# EAGLE design STM32F10XCXT6 (EAGLE 9.6.2)
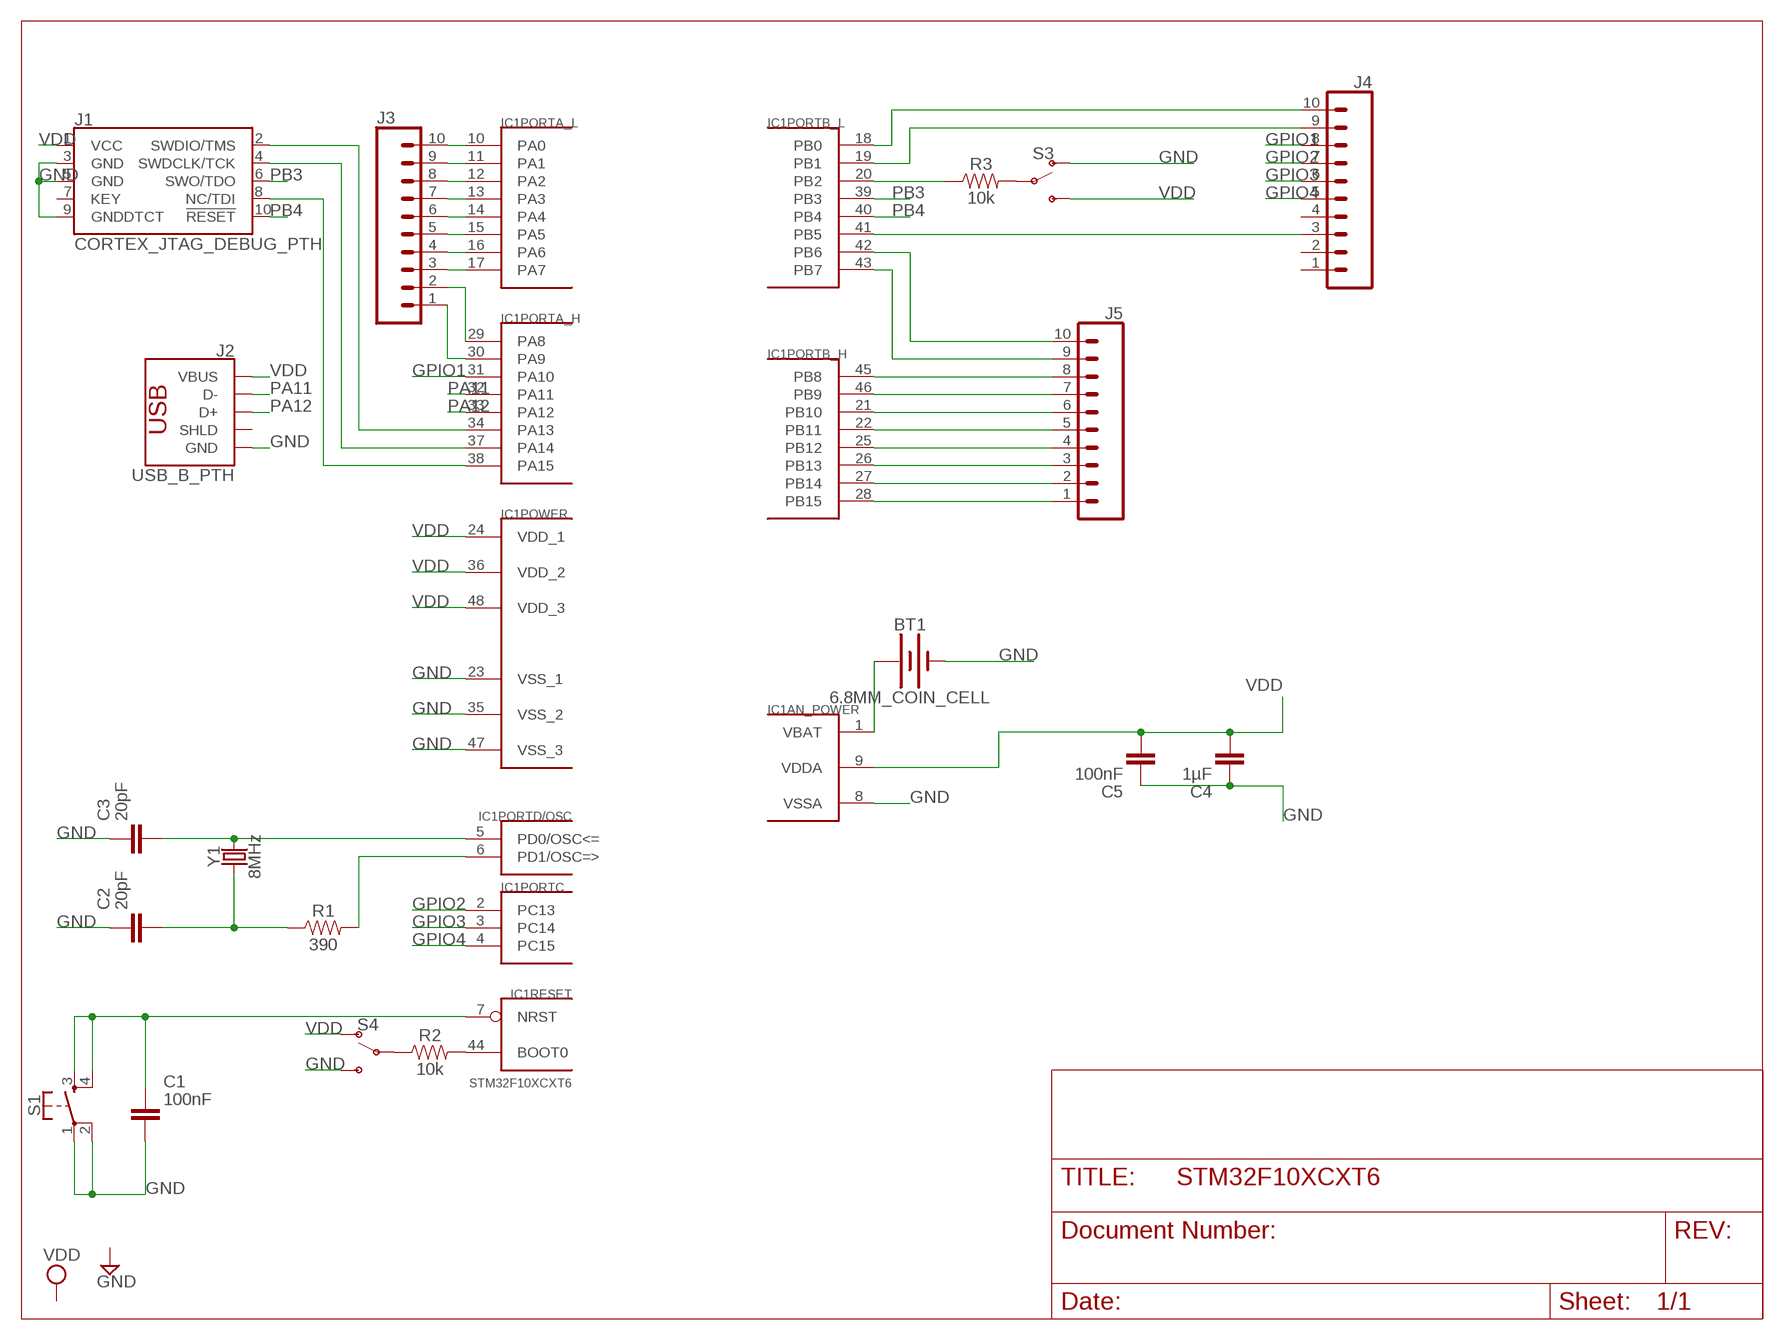
[diagram p0: schematic, sheet 1]

## Parts
BT1  6.8MM_COIN_CELL  BATTERY-6.8MM_SMD  [BATTCON-6.8MM]
C1  100nF  C  (no package)
C2  20pF  C  (no package)
C3  20pF  C  (no package)
C4  1µF  C  (no package)
C5  100nF  C  (no package)
IC1  STM32F10XCXT6  [TQFP48]
J1  CORTEX_JTAG_DEBUG_PTH  [2X5-PTH-1.27MM]
J2  USB_B_PTH  [USB-B-PTH]
J3  CONN_10"  [1X10]
J4  CONN_10"  [1X10]
J5  CONN_10"  [1X10]
R1  390  390OHM-0603-1/10W-1%  [0603]
R2  10k  10KOHM-0402-1/16W-1%  [0402]
R3  10k  10KOHM-0402-1/16W-1%  [0402]
S1  MOMENTARY-SWITCH-SPST-2-SMD-4.6X2.8MM  [TACTILE_SWITCH_SMD_4.6X2.8MM]
S3  SWITCH-SPDT-PTH-8.6X4.3MM  [SWITCH_SPDT_8.6X4.3MM]
S4  SWITCH-SPDT-PTH-8.6X4.3MM  [SWITCH_SPDT_8.6X4.3MM]
Y1  8MHz  CRYSTALPTH-2X6  [CRYSTAL-PTH-2X6-CYL]

## Nets
GND: BT1.- C1.2 C2.1 C3.1 C4.1 C5.1 IC1.8(AN_POWER:VSSA) IC1.23(POWER:VSS_1) IC1.35(POWER:VSS_2) IC1.47(POWER:VSS_3) J1.3(GND) J1.5(GND) J1.9(GNDDTCT) J2.GND S1.1 S1.2 S3.1(O) S4.3(S)
GPIO1: IC1.31(PORTA_H:PA10) J4.8
GPIO2: IC1.2(PORTC:PC13) J4.7
GPIO3: IC1.3(PORTC:PC14) J4.6
GPIO4: IC1.4(PORTC:PC15) J4.5
N$1: IC1.10(PORTA_L:PA0) J3.10
N$2: C1.1 IC1.7(RESET:NRST) S1.3 S1.4
N$3: C3.2 IC1.5(PORTD/OSC:PD0/OSC<=) Y1.2
N$4: IC1.6(PORTD/OSC:PD1/OSC=>) R1.2
N$5: C2.2 R1.1 Y1.1
N$6: IC1.44(RESET:BOOT0) R2.2
N$7: R2.1 S4.2(P)
N$8: IC1.20(PORTB_L:PB2) R3.1
N$9: R3.2 S3.2(P)
N$10: IC1.34(PORTA_H:PA13) J1.2(SWDIO/TMS)
N$11: IC1.37(PORTA_H:PA14) J1.4(SWDCLK/TCK)
N$12: IC1.38(PORTA_H:PA15) J1.8(NC/TDI)
N$13: BT1.+ IC1.1(AN_POWER:VBAT)
N$14: IC1.45(PORTB_H:PB8) J5.8
N$15: IC1.46(PORTB_H:PB9) J5.7
N$16: IC1.21(PORTB_H:PB10) J5.6
N$17: IC1.22(PORTB_H:PB11) J5.5
N$18: IC1.25(PORTB_H:PB12) J5.4
N$19: IC1.26(PORTB_H:PB13) J5.3
N$20: IC1.27(PORTB_H:PB14) J5.2
N$21: IC1.28(PORTB_H:PB15) J5.1
N$22: IC1.18(PORTB_L:PB0) J4.10
N$23: IC1.19(PORTB_L:PB1) J4.9
N$24: IC1.41(PORTB_L:PB5) J4.3
N$25: IC1.42(PORTB_L:PB6) J5.10
N$26: IC1.43(PORTB_L:PB7) J5.9
N$27: IC1.11(PORTA_L:PA1) J3.9
N$28: IC1.12(PORTA_L:PA2) J3.8
N$29: IC1.13(PORTA_L:PA3) J3.7
N$30: IC1.14(PORTA_L:PA4) J3.6
N$31: IC1.15(PORTA_L:PA5) J3.5
N$32: IC1.16(PORTA_L:PA6) J3.4
N$33: IC1.17(PORTA_L:PA7) J3.3
N$34: IC1.29(PORTA_H:PA8) J3.2
N$35: IC1.30(PORTA_H:PA9) J3.1
PA11: IC1.32(PORTA_H:PA11) J2.D-
PA12: IC1.33(PORTA_H:PA12) J2.D+
PB3: IC1.39(PORTB_L:PB3) J1.6(SWO/TDO)
PB4: IC1.40(PORTB_L:PB4) J1.10(!RESET)
VDD: C4.2 C5.2 IC1.9(AN_POWER:VDDA) IC1.24(POWER:VDD_1) IC1.36(POWER:VDD_2) IC1.48(POWER:VDD_3) J1.1(VCC) J2.VBUS S3.3(S) S4.1(O)
Unconnected: J1.7(KEY) J2.SHLD1(SHLD) J2.SHLD2(SHLD) J4.1 J4.2 J4.4

## Library data of the parts
BT1 = SparkFun-Batteries:BATTERY: Battery - Single Cell A variety of battery chemistries, sizes, and footprints. Device List: 20MM_PTH - Coin Cell Battery Holder - 20mm (PTH) <https://www.sparkfun.com/products/783> 20MM_PTH_KIT- Coin Cell battery Holder - 20 mm (PTH) <http://www.sparkfun.com/products/783>kit version with special mask 6.8MM_PTH - Coin Cell Battery Holder - 6.8MM(SMD) <https://www.digikey.com/product-detail/en/seiko-instruments/MS621FE-FL11E/728-1057-ND/1889208?WT.srch=1&gclid=CNOQ5a6LzdQCFZS2wAodXCkE0g> 12MM_SMD - Coin Cell Battery Holder - 12mm (SMD) <https://www.sparkfun.com/products/10592> 12MM_PTH - Coin Cell Battery Holder - 12mm (PTH) <https://www.sparkfun.com/products/7948> 20MM_SMD - 20mm Coin Cell Battery Holder (SMD) (2 legs) Used on the Big Time Watch Kit <https://www.sparkfun.com/products/11734> 20MM_SMD_4LEGS - Coin Cell Battery Holder - 20mm (SMD) <https://www.sparkfun.com/products/11892> 20MM_SMD_4LEGS_OVERPASTE - Coin Cell Battery Holder - 20mm (SMD) <https://www.sparkfun.com/products/11892> (Over-paste on the legs) 24.5MM_PTH - Coin Cell Battery Holder - 24.5mm (PTH) <https://www.sparkfun.com/products/8863> 9V - 9V Battery Holder - PC Mount Used on the SparkFun SparkPunk Sound Kit <https://www.sparkfun.com/products/11177> and SparkFun SparkPunk Sequencer Kit <https://www.sparkfun.com/products/12707> 18650 - Battery Holder - 18650 (PTH) <https://www.sparkfun.com/products/13113> AA - Battery Holder - 1xAA (PTH) <https://www.sparkfun.com/products/7949> AAA - Battery Holder - 1xAAA (PTH) <https://www.sparkfun.com/products/12718> AA_KIT - Battery Holder - 1xAA (PTH) <https://www.sparkfun.com/products/7949> Special kit package - pads only have exposed copper on one side of the board. AAA_KIT - Battery Holder - 1xAAA (PTH) <https://www.sparkfun.com/products/12718> Special kit package - pads only have exposed copper on one side of the board.; PROD_ID: BATT-13734
C1-C5 = ngspice-simulation:C: CAPACITOR; _EXTERNAL_: 100nF
IC1 = stm32:STM32F10XCXT6: ST STM32F101/103 48pin LQFP
J1 = SparkFun-Connectors:CORTEX_JTAG_DEBUG: Cortex Debug Connector - 10 pin Supports JTAG debug, Serial Wire debug, and Serial Wire Viewer. PTH and SMD connector options available. General Connector Information <http://infocenter.arm.com/help/topic/com.arm.doc.faqs/attached/13634/cortex_debug_connectors.pdf> Products: PTH Connector <http://www.digikey.com/product-detail/en/cnc-tech/3220-10-0100-00/1175-1627-ND/3883661> -via Digi-Key SparkFun PSoc <https://www.sparkfun.com/products/13229> SparkFun T <https://www.sparkfun.com/products/13810>
J2 = SparkFun-Connectors:USB_B: USB Type B Connector SparkFun Products: SparkFun Stepoko <https://www.sparkfun.com/products/13899> PTH; PROD_ID: CONN-08278; SF_ID: PRT-00139
J3-J5 = SparkFun-Connectors:CONN_10: Multi connection point. Often used as Generic Header-pin footprint for 0.1 inch spaced/style header connections On any of the 0.1 inch spaced packages, you can populate with these: Break Away Headers - Straight <https://www.sparkfun.com/products/116> (PRT-00116) Break Away Male Headers - Right Angle <https://www.sparkfun.com/products/553> (PRT-00553) Female Headers <https://www.sparkfun.com/products/115> (PRT-00115) Break Away Headers - Machine Pin <https://www.sparkfun.com/products/117> (PRT-00117) Break Away Female Headers - Swiss Machine Pin <https://www.sparkfun.com/products/743> (PRT-00743) Arduino Stackable Header - 10 Pin <https://www.sparkfun.com/products/11376> (PRT-11376) For SCREWTERMINALS and SPRING TERMINALS visit here: Screw Terimnals on SparkFun.com <https://www.sparkfun.com/search/results?term=Screw+Terminals> (5mm/3.5mm/2.54mm spacing) This device is also useful as a general connection point to wire up your design to another part of your project. Our various solder wires solder well into these plated through hole pads. Hook-Up Wire - Assortment (Stranded, 22 AWG) <https://www.sparkfun.com/products/11375> (PRT-11375) Hook-Up Wire - Assortment (Solid Core, 22 AWG) <https://www.sparkfun.com/products/11367> (PRT-11367) View the entire wire category on our website here <https://www.sparkfun.com/categories/141> Special notes: Molex polarized connector foot print use with SKU : PRT-08231 with associated crimp pins and housings. 1MM SMD Version SKU: PRT-10208 NOTES ON THE VARIANTS LOCK and LOCK_LONGPADS... This footprint was designed to help hold the alignment of a through-hole component (i.e. 6-pin header) while soldering it into place. You may notice that each hole has been shifted either up or down by 0.005 of an inch from it's more standard position (which is a perfectly straight line). This slight alteration caused the pins (the squares in the middle) to touch the edges of the holes. Because they are alternating, it causes a "brace" to hold the component in place. 0.005 has proven to be the perfect amount of "off-center" position when using our standard breakaway headers. Although looks a little odd when you look at the bare footprint, once you have a header in there, the alteration is very hard to notice. Also,if you push a header all the way into place, it is covered up entirely on the bottom side.; PROD_ID: CONN-11563
R1 = SparkFun-Resistors:390OHM: 390Ω resistor A resistor is a passive two-terminal electrical component that implements electrical resistance as a circuit element. Resistors act to reduce current flow, and, at the same time, act to lower voltage levels within circuits. - Wikipedia; PROD_ID: RES-07864
R2 R3 = SparkFun-Resistors:10KOHM: 10kΩ resistor A resistor is a passive two-terminal electrical component that implements electrical resistance as a circuit element. Resistors act to reduce current flow, and, at the same time, act to lower voltage levels within circuits. - Wikipedia; PROD_ID: RES-14241
S1 = SparkFun-Switches:MOMENTARY-SWITCH-SPST-2: Momentary Switch (Pushbutton) - SPST - Two Circuits Normally-open (NO) SPST momentary switches (buttons, pushbuttons). Schematic symbol includes two switch circuits. Variants SMD-4.6MMX2.8MM - 4.60mm x 2.80mm Tactile Momentary Button Switch - Used on SparkFun Pro Micro - RP2040 <https://www.sparkfun.com/products/17717> SMD-5.2MM - Mini Pushbutton Switch - SMD <https://www.sparkfun.com/products/8720> - Used on Arduino Pro Mini <https://www.sparkfun.com/products/11114>; PROD_ID: SWCH-15606
S3 S4 = SparkFun-Switches:SWITCH-SPDT: Single Pole, Double Throw (SPDT) Switch Single-pole, double-throw (SPDT) switch. Variant Overview SMD-AYZ0202 Surface Mount DPDT Switch <https://www.sparkfun.com/products/597> (COM-00597) Used on e.g. LilyPad Arduino USB - ATmega32U4 Board <https://www.sparkfun.com/products/12049> PTH-11.6X4.0MM SPDT Mini Power Switch <https://www.sparkfun.com/products/102> (COM-00102) Used on e.g. SparkFun Simon Says - Through-Hole Soldering Kit <https://www.sparkfun.com/products/10547> (KIT-10547) PTH-11.6X4.0MM-KIT KIT version of SPDT Mini Power Switch - Simplifies soldering by removing tStop of switch pins - only one side can be soldered. PTH-11.6X4.0MM-LOCK LOCK version of SPDT Mini Power Switch - Offset pins hold switch in place for easier soldering. SMD-RIGHT-ANGLE Surface Mount Right Angle Switch <https://www.sparkfun.com/products/10860> (COM-10860) Used on e.g. SparkFun ESP8266 Thing <https://www.sparkfun.com/products/13231>; PROD_ID: SWCH-14746
Y1 = SparkFun-Clocks:CRYSTAL: Crystals (Generic) These are passive quartz crystals, which can be used as a clock source for a microcontroller. Crystal's are two-terminal devices. They require external "load" capacitors to generate an oscillating signal.

## Board
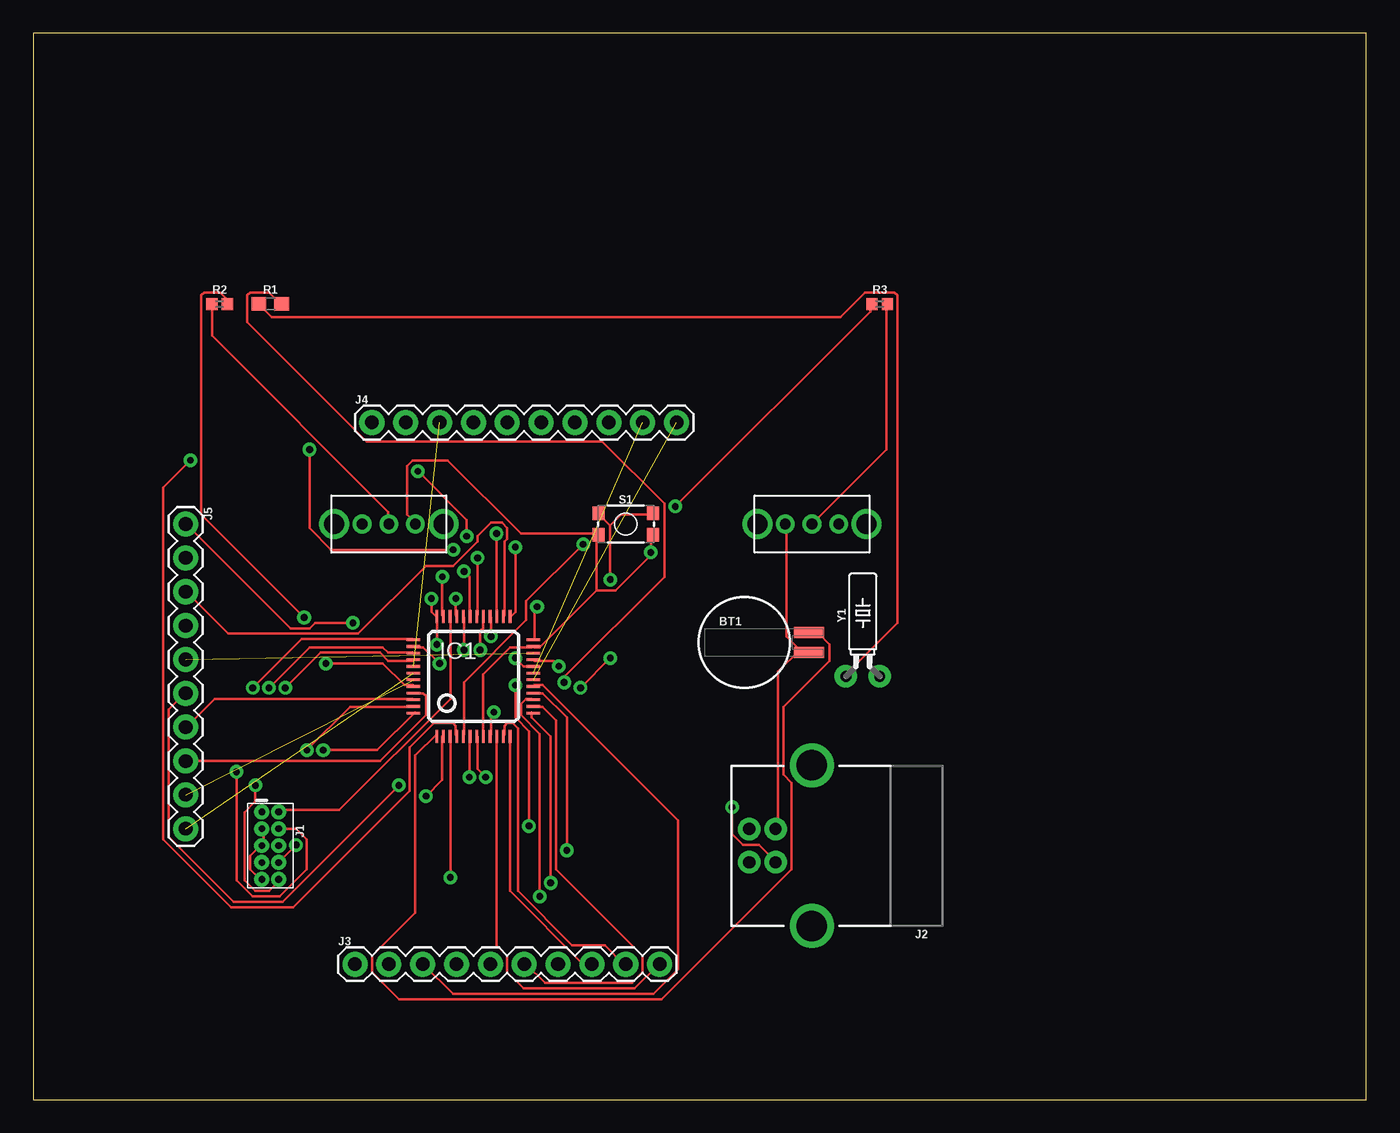
[diagram p1: board, top side]
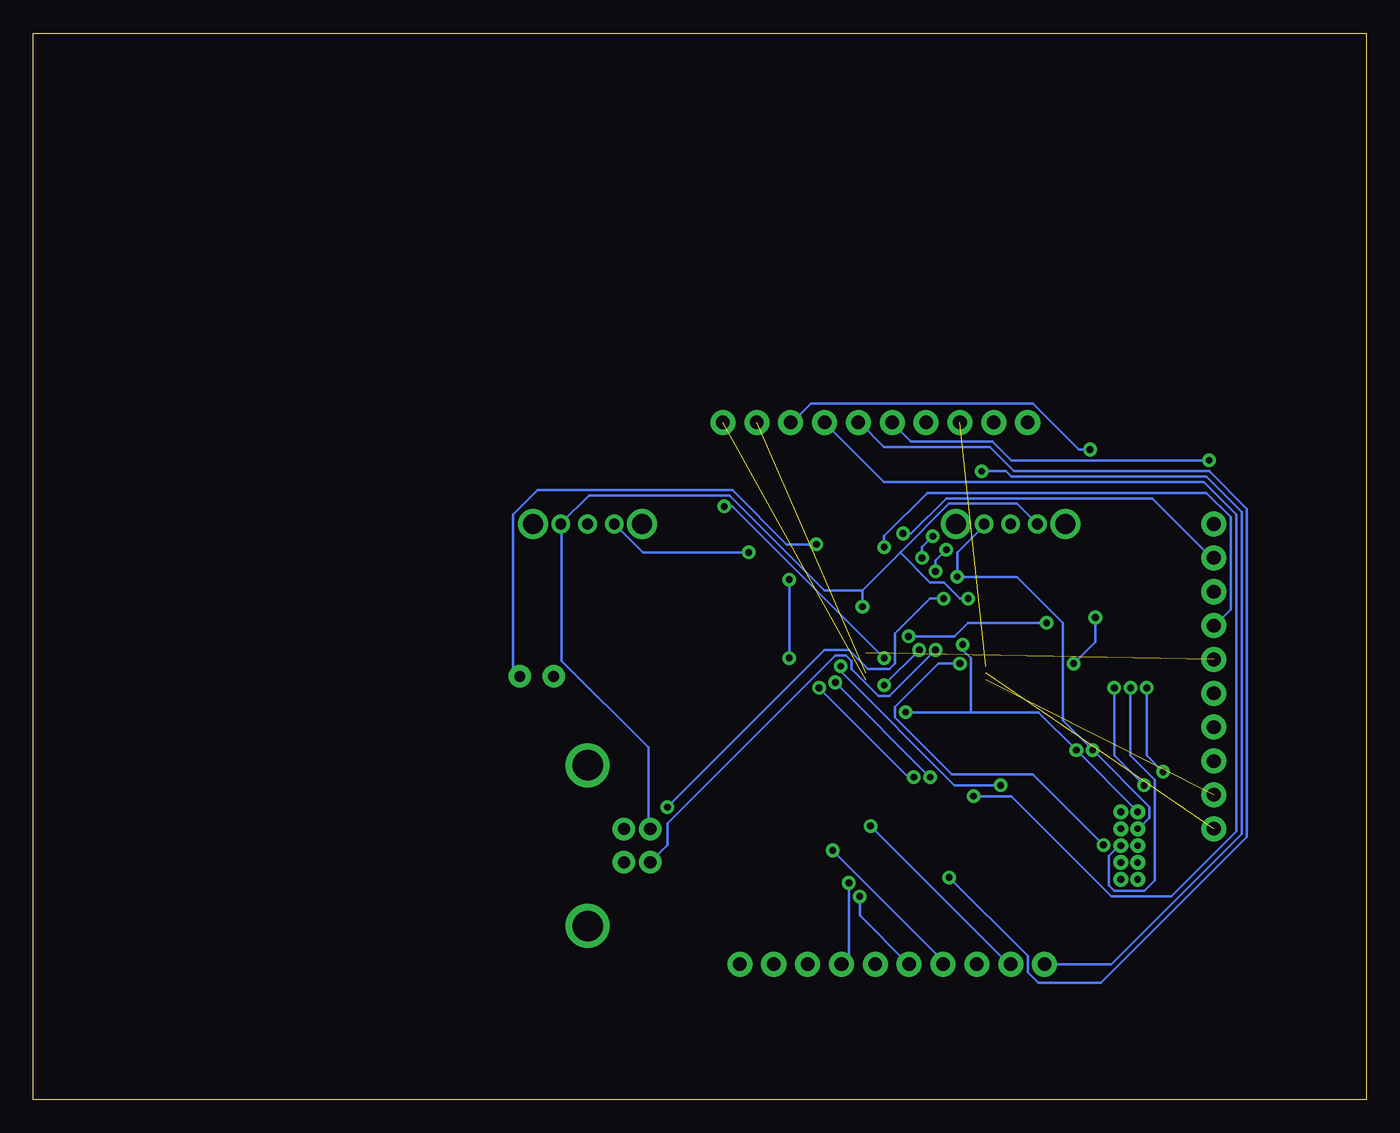
[diagram p2: board, bottom side, seen from below]

Size 100 x 80 mm. Coordinates in mm from the lower left corner, seen from the top.
Outline: 0,0 100,0 100,80 0,80 0,0
Copper layers (1*16): Top 0.035mm / dielectric 1.5mm / Bottom 0.035mm
Design rules "SparkFun": minimum track width 8mil, minimum drill 20mil, track to track 8mil, track to pad 8mil, pad to pad 8mil, via to via 8mil, smd to smd 8mil, copper to edge 8mil, drill to drill 8mil, minimum pad ring 12mil, minimum via ring 10mil, stop-mask expansion 4mil, vias tented up to drill 20mil, thermal gap 10mil

### Footprints (pad centres in the part's own frame; a part is rotated, then mirrored left to right if it is on the bottom)
BATTCON-6.8MM = smd 2.25 x 0.85: + 4.87,0.75; - 4.87,-0.75
TQFP48 = smd 0.2 x 1: 1 -2.75,-4.5; 2 -2.25,-4.5; 3 -1.75,-4.5; 4 -1.25,-4.5; 5 -0.75,-4.5; 6 -0.25,-4.5; 7 0.25,-4.5; 8 0.75,-4.5; 9 1.25,-4.5; 10 1.75,-4.5; 11 2.25,-4.5; 12 2.75,-4.5; 25 2.75,4.5; 26 2.25,4.5; 27 1.75,4.5; 28 1.25,4.5; 29 0.75,4.5; 30 0.25,4.5; 31 -0.25,4.5; 32 -0.75,4.5; 33 -1.25,4.5; 34 -1.75,4.5; 35 -2.25,4.5; 36 -2.75,4.5 | smd 1 x 0.2: 13 4.5,-2.75; 14 4.5,-2.25; 15 4.5,-1.75; 16 4.5,-1.25; 17 4.5,-0.75; 18 4.5,-0.25; 19 4.5,0.25; 20 4.5,0.75; 21 4.5,1.25; 22 4.5,1.75; 23 4.5,2.25; 24 4.5,2.75; 37 -4.5,2.75; 38 -4.5,2.25; 39 -4.5,1.75; 40 -4.5,1.25; 41 -4.5,0.75; 42 -4.5,0.25; 43 -4.5,-0.25; 44 -4.5,-0.75; 45 -4.5,-1.25; 46 -4.5,-1.75; 47 -4.5,-2.25; 48 -4.5,-2.75
2X5-PTH-1.27MM = drill 0.508 pad 1: 1 -2.54,-0.635; 2 -2.54,0.635; 3 -1.27,-0.635; 4 -1.27,0.635; 5 0,-0.635; 6 0,0.635; 7 1.27,-0.635; 8 1.27,0.635; 9 2.54,-0.635; 10 2.54,0.635
USB-B-PTH = drill 0.914 pad 1.676: D+ 4,1.25; D- 5.981,1.25; GND 4,-1.25; VBUS 5.981,-1.25 | drill 2.286: SHLD1 1.282,-6.02; SHLD2 1.282,6.02
1X10 = drill 1.016 pad 1.88: 1 0,0; 2 2.54,0; 3 5.08,0; 4 7.62,0; 5 10.16,0; 6 12.7,0; 7 15.24,0; 8 17.78,0; 9 20.32,0; 10 22.86,0
0603 = smd 1.1 x 1: 1 -0.85,0; 2 0.85,0
0402 = smd 0.85 x 0.9: 1 -0.58,0; 2 0.58,0
TACTILE_SWITCH_SMD_4.6X2.8MM = smd 0.9 x 1: 1 -2.05,-0.8; 2 2.05,-0.8; 3 2.05,0.8; 4 -2.05,0.8
SWITCH_SPDT_8.6X4.3MM = drill 0.8: 1 -2,0; 2 0,0; 3 2,0 | drill 1.5: 4 -4.1,0; 5 4.1,0
CRYSTAL-PTH-2X6-CYL = drill 0.813 pad 1.676: 1 -1.27,0; 2 1.27,0

### Placement (x,y rotation side)
BT1  53.34,34.29 0 top
IC1  33.02,31.75 0 top
J1  17.78,19.05 270 top
J2  59.69,19.05 180 top
J3  24.13,10.16 0 top
J4  25.4,50.8 0 top
J5  11.43,43.18 270 top
R1  17.78,59.69 0 top
R2  13.97,59.69 0 top
R3  63.5,59.69 0 top
S1  44.45,43.18 0 top
S3  58.42,43.18 0 top
S4  26.67,43.18 0 top
Y1  62.23,31.75 0 top

### Tracks (layer width: path | path; a pad name or v marks a point on that pad's centre or on a via)
GND  (via drill 0.51)
  Top 0.203: 57.51,33.73 58.12,33.73 BT1.- 57.51,33.73 | 57.51,33.73 56.49,34.75 56.49,43.08 S3.1 | 57.51,33.73 55.88,32.11 55.88,20.32 J2.GND | IC1.8 33.73,27.43 33.73,31.9 35.76,33.93 37.39,33.93 IC1.23 37.59,33.93 38,33.93 42.27,38.2 | 42.27,38.2 42.27,42.27 S1.1 42.27,42.47 36.58,42.47 31.09,47.95 28.45,47.95 28.04,47.55 28.04,43.89 28.65,43.28 S4.3 | 42.27,38.2 43.69,38.2 46.33,40.84 v46.33,41.05 46.33,42.27 S1.2 | v30.68,39.22 30.68,36.37 IC1.35 | J1.9 17.07,16.66 16.87,16.66 16.26,17.27 16.26,18.29 17.07,19.1 J1.5 17.27,19.1 17.27,20.32 J1.3 | v20.52,26.21 23.77,29.46 28.45,29.46 IC1.47
  Bottom 0.203: S4.3 28.65,43.08 30.68,41.05 v30.68,39.22 26.21,39.22 22.76,35.76 22.76,28.45 v20.52,26.21 16.26,21.95 16.26,21.13 17.07,20.32 J1.3 | v46.33,41.05 54.25,41.05 56.29,43.08 S3.1
GPIO1  (via drill 0.51)
  Top 0.203: v32.31,39.62 32.72,39.22 32.72,36.37 IC1.31 | v31.5,41.25 22.35,41.25 20.73,42.88 v20.73,48.77
  Bottom 0.203: v32.31,39.62 32.31,40.44 v31.5,41.25 | v20.73,48.77 21.54,48.77 24.99,52.22 41.66,52.22 43.08,50.8 J4.8
GPIO2  (via drill 0.51)
  Top 0.203: v29.46,22.76 30.68,23.98 30.68,27.23 IC1.2
  Bottom 0.203: v29.46,22.76 26.62,22.76 19.1,15.24 14.63,15.24 9.75,20.12 9.75,43.89 12.19,46.33 36.17,46.33 J4.7
GPIO3  (via drill 0.51)
  Top 0.203: v31.29,16.66 31.29,27.23 IC1.3
  Bottom 0.203: v31.29,16.66 25.4,10.77 25.4,9.55 24.59,8.74 19.91,8.74 8.94,19.71 8.94,44.3 11.79,47.14 26.42,47.14 28.25,48.97 36.17,48.97 38,50.8 J4.6
GPIO4  (via drill 0.51)
  Top 0.203: v11.79,47.95 9.75,45.92 9.75,19.51 14.83,14.43 19.51,14.43 28.25,23.16 28.25,26.42 30.07,28.25 31.5,28.25 31.7,28.04 31.7,27.43 IC1.4
  Bottom 0.203: v11.79,47.95 26.62,47.95 28.04,49.38 34.14,49.38 J4.5
N$1
  Top 0.203: IC1.10 34.75,27.23 34.75,11.58 35.56,10.77 35.56,9.55 36.78,8.33 45.11,8.33 46.94,10.16 J3.10
N$2  (via drill 0.51)
  Top 0.203: v33.93,24.18 33.33,24.79 33.33,27.23 IC1.7 | v43.28,33.12 v41.05,30.89 | 43.28,43.08 v43.28,39.01 | 43.28,43.08 42.47,43.89 S1.4 | 43.28,43.08 44.09,43.89 46.33,43.89 S1.3
  Bottom 0.203: v33.93,24.18 34.34,24.18 v41.05,30.89 | v43.28,39.01 v43.28,33.12
N$3  (via drill 0.51)
  Top 0.203: v41.25,41.66 36.98,37.39 36.98,35.97 32.31,31.29 32.31,27.43 IC1.5
  Bottom 0.203: v41.25,41.66 43.48,41.66 47.55,45.72 62.18,45.72 64.01,43.89 64.01,32.31 63.6,31.9 Y1.2
N$4  (via drill 0.51)
  Top 0.203: v32.72,24.18 32.72,27.23 IC1.6 | v39.83,31.29 39.83,31.7 47.35,39.22 47.35,44.7 42.67,49.38 24.99,49.38 16.05,58.32 16.05,60.35 16.26,60.55 17.68,60.55 18.49,59.74 R1.2
  Bottom 0.203: v39.83,31.29 v32.72,24.18
N$5
  Top 0.203: R1.1 17.07,59.54 17.88,58.73 60.55,58.73 62.38,60.55 64.62,60.55 64.82,60.35 64.82,35.76 60.96,31.9 Y1.1
N$6  (via drill 0.51)
  Top 0.203: v20.32,36.17 12.6,43.89 12.6,60.35 12.8,60.55 14.02,60.55 14.43,60.15 14.43,59.74 R2.2 | v21.95,32.72 26.21,32.72 27.84,31.09 28.45,31.09 IC1.44
  Bottom 0.203: v20.32,36.17 20.32,34.34 v21.95,32.72
N$7
  Top 0.203: R2.1 13.41,59.54 13.41,57.3 26.62,44.09 26.62,43.28 S4.2
N$8  (via drill 0.51)
  Top 0.203: v48.16,44.5 62.79,59.13 62.79,59.54 R3.1 | v36.17,33.12 36.78,32.51 37.39,32.51 IC1.20
  Bottom 0.203: v48.16,44.5 47.55,44.5 v36.17,33.12
N$9
  Top 0.203: S3.2 64.01,48.77 64.01,59.54 R3.2
N$10
  Top 0.203: IC1.34 31.29,36.17 31.29,30.07 22.96,21.74 18.49,21.74 J1.2
N$11  (via drill 0.51)
  Top 0.203: v16.46,30.89 20.12,34.54 28.45,34.54 IC1.37 | v15.24,24.59 15.24,16.46 16.46,15.24 18.49,15.24 20.52,17.27 20.52,19.51 19.71,20.32 J1.4
  Bottom 0.203: v16.46,30.89 16.46,25.81 v15.24,24.59
N$12  (via drill 0.51)
  Top 0.203: v30.48,32.72 29.26,33.93 28.65,33.93 IC1.38 | v19.71,19.1 18.49,17.88 J1.8
  Bottom 0.203: v30.48,32.72 32.11,32.72 35.36,29.46 35.36,28.65 31.09,24.38 24.99,24.38 v19.71,19.1
N$13
  Top 0.203: IC1.1 30.28,27.43 28.65,25.81 28.65,14.02 25.4,10.77 25.4,9.55 27.43,7.52 47.14,7.52 56.9,17.27 56.9,23.77 56.29,24.38 56.29,29.46 59.74,32.92 59.74,34.14 58.93,34.95 58.32,34.95 BT1.+
N$14
  Top 0.203: J5.8 26.01,25.4 29.46,28.85 29.46,30.28 29.26,30.48 28.65,30.48 IC1.45
N$15
  Top 0.203: IC1.46 28.45,30.07 13.61,30.07 11.58,28.04 J5.7
N$16  (via drill 0.51)
  Top 0.203: v39.42,32.51 39.01,32.92 37.59,32.92 IC1.21 | v27.43,23.57 18.69,14.83 15.04,14.83 10.16,19.71 10.16,29.26 11.38,30.48 J5.6
  Bottom 0.203: v39.42,32.51 39.42,32.11 30.89,23.57 v27.43,23.57
N$17  (1 unrouted)
N$18  (via drill 0.51)
  Top 0.203: v36.17,41.45 36.17,36.58 35.76,36.17 IC1.25
  Bottom 0.203: v36.17,41.45 36.17,42.27 32.92,45.52 11.99,45.52 10.16,43.69 10.16,36.78 11.38,35.56 J5.4
N$19
  Top 0.203: IC1.26 35.36,36.37 35.36,41.86 35.56,42.06 35.56,42.88 35.15,43.28 34.34,43.28 33.33,42.27 33.33,41.86 31.5,40.03 29.46,40.03 24.38,34.95 14.63,34.95 11.58,38 J5.3
N$20  (via drill 0.51)
  Top 0.203: v34.75,42.47 34.75,36.37 IC1.27
  Bottom 0.203: v34.75,42.47 34.14,42.47 31.5,45.11 16.05,45.11 11.58,40.64 J5.2
N$21  (via drill 0.51)
  Top 0.203: v34.34,34.75 34.34,36.17 IC1.28 | v23.98,35.76 21.13,35.76 20.73,35.36 19.3,35.36 11.58,43.08 J5.1
  Bottom 0.203: v34.34,34.75 30.89,34.75 29.87,35.76 v23.98,35.76
N$22  (1 unrouted)
N$23  (1 unrouted)
N$24  (1 unrouted)
N$25  (1 unrouted)
N$26  (1 unrouted)
N$27
  Top 0.203: IC1.11 35.36,27.43 35.36,28.04 35.56,28.25 35.97,28.25 36.37,27.84 36.37,15.65 40.44,11.58 42.88,11.58 44.3,10.16 J3.9
N$28
  Top 0.203: J3.8 41.25,10.16 35.76,15.65 35.76,27.23 IC1.12
N$29  (via drill 0.51)
  Top 0.203: v38.81,16.26 38.81,27.23 37.39,28.65 37.39,29.06 IC1.13
  Bottom 0.203: v38.81,16.26 38.81,10.57 39.22,10.16 J3.7
N$30
  Top 0.203: IC1.14 37.59,29.46 38.2,29.46 39.22,28.45 39.22,17.27 45.72,10.77 45.72,9.55 44.91,8.74 38.41,8.74 36.98,10.16 J3.6
N$31  (via drill 0.51)
  Top 0.203: v38,15.24 38,27.43 36.58,28.85 36.58,29.67 36.98,30.07 37.39,30.07 IC1.15
  Bottom 0.203: v38,15.24 38,13.82 34.34,10.16 J3.5
N$32  (via drill 0.51)
  Top 0.203: v40.03,18.69 40.03,28.65 38.2,30.48 37.59,30.48 IC1.16
  Bottom 0.203: v40.03,18.69 31.9,10.57 31.9,10.16 J3.4
N$33
  Top 0.203: IC1.17 37.59,31.09 38.2,31.09 48.36,20.93 48.36,9.75 46.53,7.92 31.5,7.92 29.26,10.16 J3.3
N$34  (via drill 0.51)
  Top 0.203: v33.53,33.73 33.53,35.15 33.73,35.36 33.73,36.17 IC1.29 | v36.17,31.09 36.17,28.65 37.19,27.64 v37.19,20.52
  Bottom 0.203: v36.17,31.09 v33.53,33.73 | v37.19,20.52 26.82,10.16 J3.2
N$35  (via drill 0.51)
  Top 0.203: v33.33,40.64 33.33,36.37 IC1.30 | v32.51,42.27 32.51,43.48 v28.85,47.14
  Bottom 0.203: v33.33,40.64 33.33,41.45 v32.51,42.27 | v28.85,47.14 27.03,47.14 26.62,46.74 11.99,46.74 9.35,44.09 9.35,19.91 19.1,10.16 J3.1
PA11  (via drill 0.51)
  Top 0.203: v32.31,33.73 32.31,36.17 IC1.32
  Bottom 0.203: v32.31,33.73 35.76,30.28 36.58,30.28 38.61,32.31 38.61,32.92 39.01,33.33 39.83,33.33 52.43,20.73 52.43,19.1 53.65,17.88 J2.D-
PA12  (via drill 0.51)
  Top 0.203: v31.7,37.59 31.7,36.37 IC1.33 | v52.43,21.95 52.43,19.91 53.24,19.1 54.46,19.1 55.68,17.88 J2.D+
  Bottom 0.203: v31.7,37.59 32.72,37.59 35.36,34.95 35.36,32.72 35.76,32.31 37.39,32.31 38.81,33.73 40.64,33.73 v52.43,21.95
PB3  (via drill 0.51)
  Top 0.203: v17.68,30.89 20.73,33.93 26.21,33.93 26.62,33.53 28.45,33.53 IC1.39
  Bottom 0.203: v17.68,30.89 17.68,25.81 15.85,23.98 15.85,16.46 16.66,15.65 18.9,15.65 19.3,16.05 19.3,18.29 18.49,19.1 J1.6
PB4  (via drill 0.51)
  Top 0.203: v18.9,30.89 21.54,33.53 26.01,33.53 26.62,32.92 28.45,32.92 IC1.40 | v16.66,23.57 16.66,22.35 15.85,21.54 15.85,16.46 16.66,15.65 17.68,15.65 18.49,16.46 J1.10
  Bottom 0.203: v18.9,30.89 18.9,25.81 v16.66,23.57
VDD  (via drill 0.51)
  Top 0.203: v21.74,26.21 25.81,26.21 28.65,29.06 IC1.48 | v34.54,29.06 34.34,28.85 34.34,27.43 IC1.9 | v30.28,34.14 30.28,36.17 | v37.8,36.98 37.59,36.78 37.59,34.54 IC1.24 | 30.28,36.17 29.87,36.58 v29.87,37.59 | 30.28,36.17 IC1.36
  Bottom 0.203: J1.1 17.27,21.74 v21.74,26.21 24.59,29.06 29.67,29.06 | 29.67,29.06 v34.54,29.06 | v30.28,34.14 30.28,33.73 29.67,33.12 29.67,29.06 | 37.8,38.2 v37.8,36.98 | 34.95,41.05 31.29,44.7 26.21,44.7 24.79,43.28 S4.1 | 34.95,41.05 37.8,38.2 | J2.VBUS 53.85,20.32 53.85,26.42 60.35,32.92 60.35,43.08 S3.3 60.35,43.28 58.32,45.31 47.75,45.31 40.64,38.2 37.8,38.2 | v29.87,37.59 30.48,37.59 31.7,38.81 32.72,38.81 34.95,41.05